# EAGLE schematic 4-Channel Lora Relay-10A v1.1 (EAGLE 6.1)
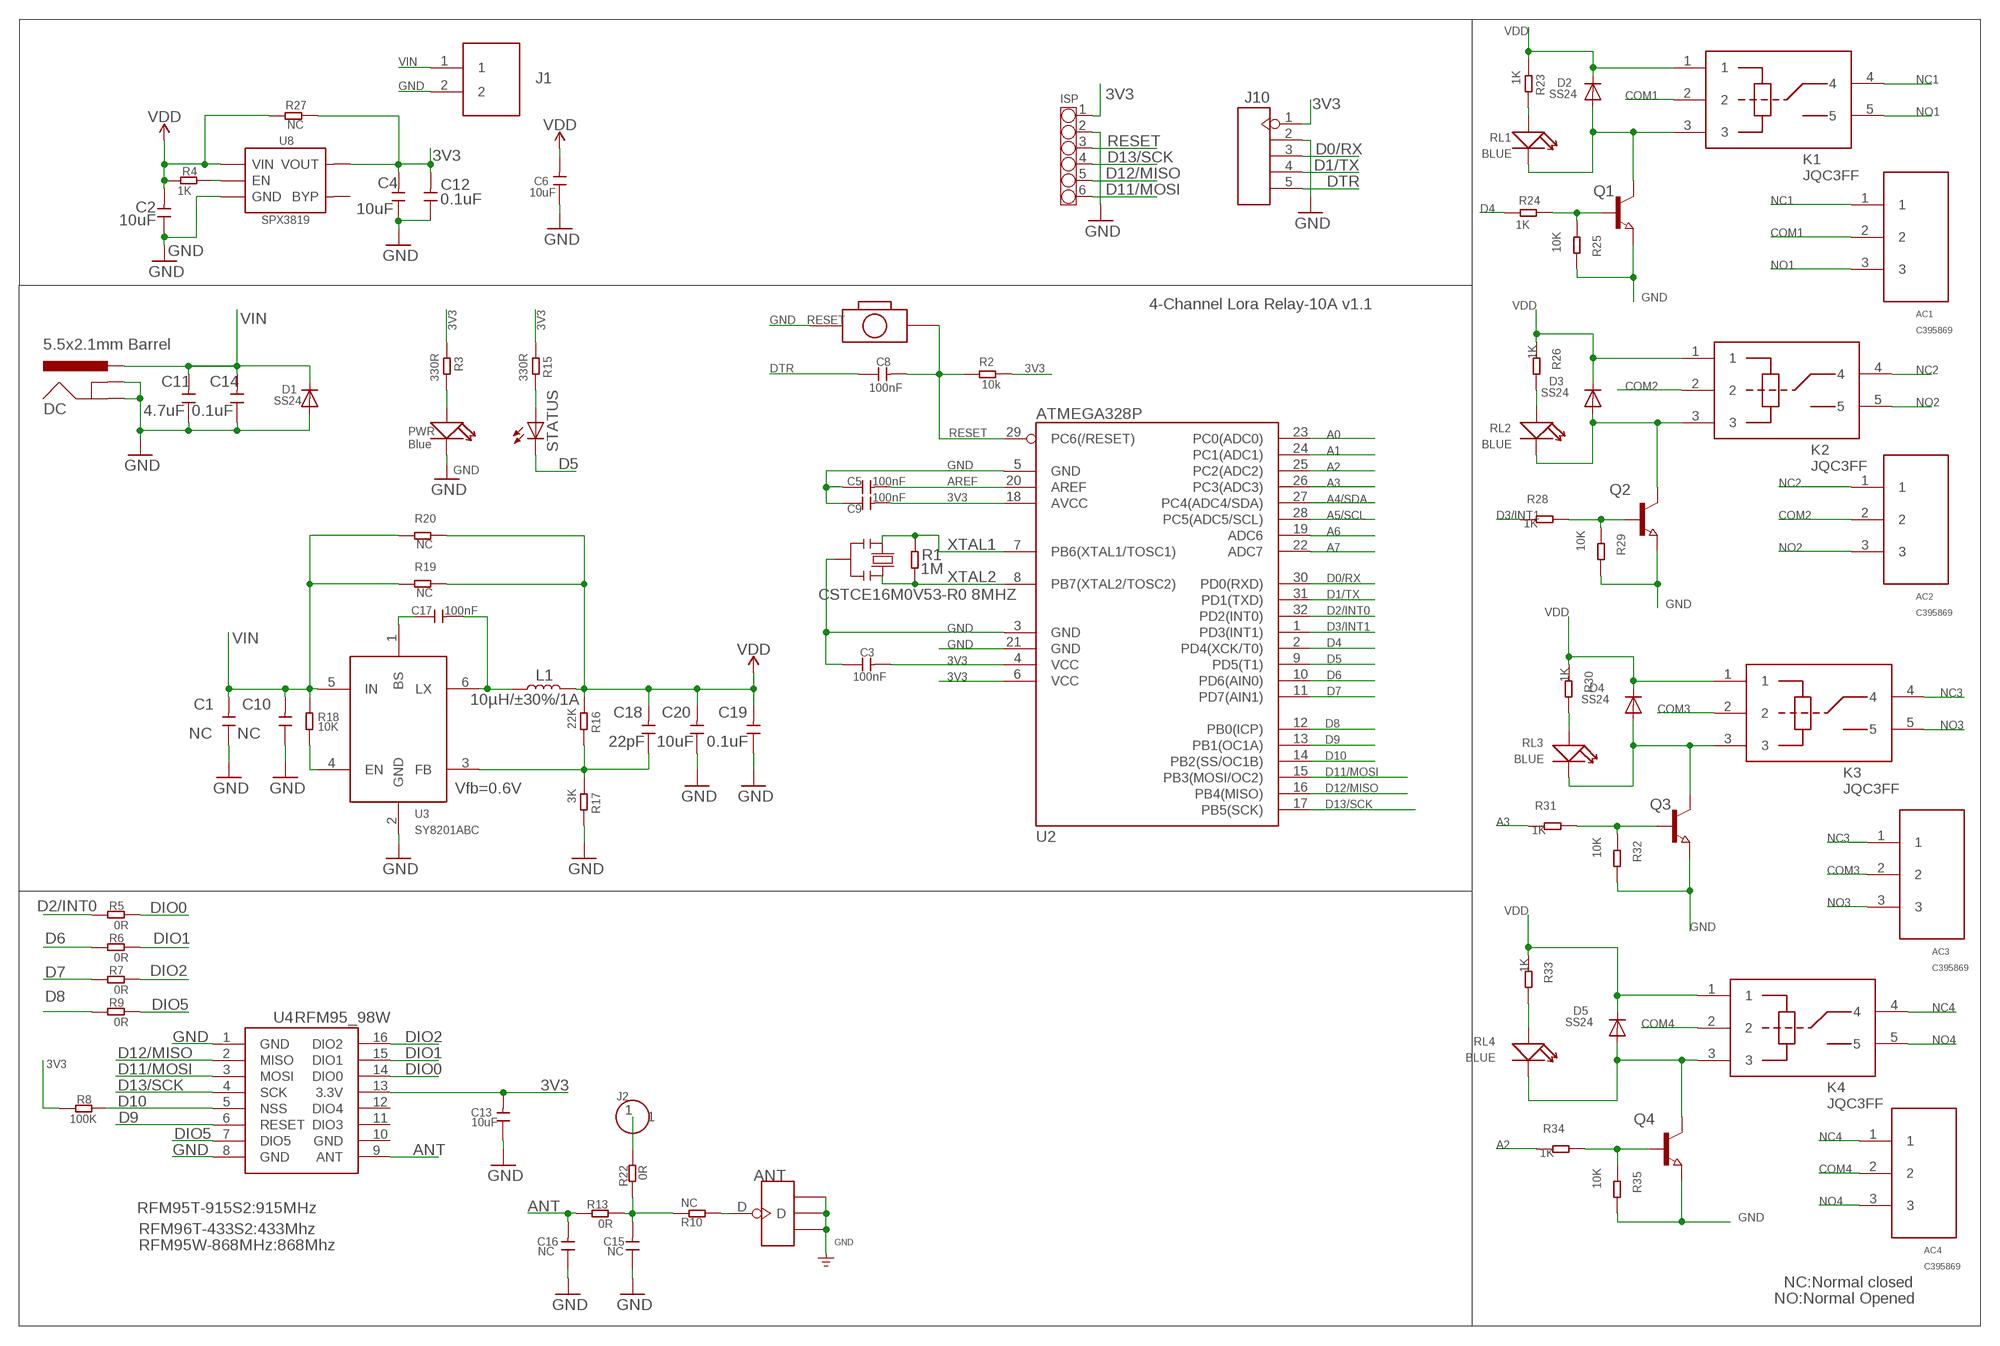
[diagram p0: schematic, sheet 1]

## Parts
AC1  C395869  [PIN_3P]
AC2  C395869  [PIN_3P]
AC3  C395869  [PIN_3P]
AC4  C395869  [PIN_3P]
ANT  ANTENNA-U-FL  [4P-U-FL]
C1  NC  C-0603  [0603]
C2  10uF  C-0603  [0603]
C3  100nF  C-0603  [0603]
C4  10uF  C-0603  [0603]
C5  100nF  C-0603  [0603]
C6  10uF  C-0603  [0603]
C8  100nF  C-0603  [0603]
C9  100nF  C-0603  [0603]
C10  NC  C-0603  [0603]
C11  4.7uF  C-0603  [0603]
C12  0.1uF  C-0603  [0603]
C13  10uF  C-0603  [0603]
C14  0.1uF  C-0603  [0603]
C15  NC  C-0603  [0603]
C16  NC  C-0603  [0603]
C17  100nF  C-0603  [0603]
C18  22pF  C-0603  [0603]
C19  0.1uF  C-0603  [0603]
C20  10uF  C-0603  [0603]
D1  SS24  DIODESMA  [SMADIODE]
D2  SS24  DIODESMA  [SMADIODE]
D3  SS24  DIODESMA  [SMADIODE]
D4  SS24  DIODESMA  [SMADIODE]
D5  SS24  DIODESMA  [SMADIODE]
DC  5.5x2.1mm Barrel  POWER_JACKSMD  [POWER_JACK_SMD]
ISP  CONNECTOR-HEADER-6P-3460270P1  [1X6P-2.54-8.5-BLACK-FEMALE]
J1  PH2.0-2P-90-DIP  [PH2.0-2P-90-DIP]
J2  HEADER-1P-50  [1P-100/50MIL]
J10  HEADER-5P-2.54  [5P-2.54]
K1  JQC3FF  [DIP5_JQC3FF]
K2  JQC3FF  [DIP5_JQC3FF]
K3  JQC3FF  [DIP5_JQC3FF]
K4  JQC3FF  [DIP5_JQC3FF]
L1  10µH/±30%/1A  INDUCTOR-CR54-47UH  [CR54]
PWR  Blue  LED'0603'  [LED-0603]
Q1  NPN-TRANSISTOR_SOT23  [SOT23]
Q2  NPN-TRANSISTOR_SOT23  [SOT23]
Q3  NPN-TRANSISTOR_SOT23  [SOT23]
Q4  NPN-TRANSISTOR_SOT23  [SOT23]
R1  1M  R-0603  [R0603]
R2  10k  R-0603  [R0603]
R3  330R  R-0603  [R0603]
R4  1K  R-0603  [R0603]
R5  0R  R-0603  [R0603]
R6  0R  R-0603  [R0603]
R7  0R  R-0603  [R0603]
R8  100K  R-0603  [R0603]
R9  0R  R-0603  [R0603]
R10  NC  R-0603  [R0603]
R13  0R  R-0603  [R0603]
R15  330R  R-0603  [R0603]
R16  22K  R-0603  [R0603]
R17  3K  R-0603  [R0603]
R18  10K  R-0603  [R0603]
R19  NC  R-0603  [R0603]
R20  NC  R-0603  [R0603]
R22  0R  R-0603  [R0603]
R23  1K  R-0603  [R0603]
R24  1K  R-0603  [R0603]
R25  10K  R-0603  [R0603]
R26  1K  R-0603  [R0603]
R27  NC  R-0603  [R0603]
R28  1K  R-0603  [R0603]
R29  10K  R-0603  [R0603]
R30  1K  R-0603  [R0603]
R31  1K  R-0603  [R0603]
R32  10K  R-0603  [R0603]
R33  1K  R-0603  [R0603]
R34  1K  R-0603  [R0603]
R35  10K  R-0603  [R0603]
RESET  BOTTON-2P-90D  [2P-7.62X3.56-90D]
RL1  BLUE  LED'0603'  [LED-0603]
RL2  BLUE  LED'0603'  [LED-0603]
RL3  BLUE  LED'0603'  [LED-0603]
RL4  BLUE  LED'0603'  [LED-0603]
STATUS  LED5MM  [LED5MM]
U2  ATMEGA328P  ATMEGA8/168/328  [TQFP32]
U3  SY8201ABC  [SOT-23-6]
U4  RFM95_98W  RFM92_93W  [RFM92_93W]
U8  SPX3819  [SOT23-5]
Y1  CSTCE16M0V53-R0 8MHZ  RESONATORMU  [RESONATOR]

## Nets
3V3: C3.2 C4.2 C9.2 C12.2 C13.2 ISP.1 J10.1 R2.1 R3.1 R8.2 R15.1 R27.2 U2.4(VCC) U2.6(VCC) U2.18(AVCC) U4.13(3.3V) U8.5(VOUT)
A0: U2.23(PC0(ADC0))
A1: U2.24(PC1(ADC1))
A2: R34.1 U2.25(PC2(ADC2))
A3: R31.1 U2.26(PC3(ADC3))
A4/SDA: U2.27(PC4(ADC4/SDA))
A5/SCL: U2.28(PC5(ADC5/SCL))
A6: U2.19(ADC6)
A7: U2.22(ADC7)
ANT: C16.2 R13.2 U4.9(ANT)
AREF: C5.2 U2.20(AREF)
COM1: AC1.2 K1.2
COM2: AC2.2 K2.2
COM3: AC3.2 K3.2
COM4: AC4.2 K4.2
D0/RX: J10.3 U2.30(PD0(RXD))
D1/TX: J10.4 U2.31(PD1(TXD))
D2/INT0: R5.1 U2.32(PD2(INT0))
D3/INT1: R28.1 U2.1(PD3(INT1))
D4: R24.1 U2.2(PD4(XCK/T0))
D5: STATUS.K(C) U2.9(PD5(T1))
D6: R6.1 U2.10(PD6(AIN0))
D7: R7.1 U2.11(PD7(AIN1))
D8: R9.1 U2.12(PB0(ICP))
D9: U2.13(PB1(OC1A)) U4.6(RESET)
D10: R8.1 U2.14(PB2(SS/OC1B)) U4.5(NSS)
D11/MOSI: ISP.6 U2.15(PB3(MOSI/OC2)) U4.3(MOSI)
D12/MISO: ISP.5 U2.16(PB4(MISO)) U4.2(MISO)
D13/SCK: ISP.4 U2.17(PB5(SCK)) U4.4(SCK)
DIO0: R5.2 U4.14(DIO0)
DIO1: R6.2 U4.15(DIO1)
DIO2: R7.2 U4.16(DIO2)
DIO5: R9.2 U4.7(DIO5)
DTR: C8.1 J10.5
GND: ANT.GND1 ANT.GND2 ANT.GND3 C1.1 C2.1 C3.1 C4.1 C5.1 C6.1 C9.1 C10.1 C11.1 C12.1 C13.1 C14.1 C15.1 C16.1 C19.1 C20.1 D1.A DC.GND(GNDBREAK) DC.P$4(GND) ISP.2 J1.2 J10.2 PWR.- Q1.2(E) Q2.2(E) Q3.2(E) Q4.2(E) R17.2 R25.2 R29.2 R32.2 R35.2 RESET.P$1 U2.3(GND) U2.5(GND) U2.21(GND) U3.2(GND) U4.1(GND) U4.8(GND) U8.2(GND) Y1.2
N$1: ANT.D R10.2
N$3: R23.2 RL1.+
N$4: C15.2 R10.1 R13.1 R22.2
N$5: R15.2 STATUS.A
N$6: C17.2 L1.P$1 U3.6(LX)
N$7: PWR.+ R3.2
N$8: C17.1 U3.1(BS)
N$9: D2.A K1.3 Q1.3(C) RL1.-
N$10: C18.1 R16.2 R17.1 U3.3(FB)
N$11: R18.2 U3.4(EN)
N$12: J2.1 R22.1
N$14: Q1.1(B) R24.2 R25.1
N$20: R26.2 RL2.+
N$21: D3.A K2.3 Q2.3(C) RL2.-
N$23: Q2.1(B) R28.2 R29.1
N$24: R4.2 U8.3(EN)
N$35: R30.2 RL3.+
N$36: D4.A K3.3 Q3.3(C) RL3.-
N$38: Q3.1(B) R31.2 R32.1
N$47: R33.2 RL4.+
N$48: D5.A K4.3 Q4.3(C) RL4.-
N$53: Q4.1(B) R34.2 R35.1
NC1: AC1.1 K1.4
NC2: AC2.1 K2.4
NC3: AC3.1 K3.4
NC4: AC4.1 K4.4
NO1: AC1.3 K1.5
NO2: AC2.3 K2.5
NO3: AC3.3 K3.5
NO4: AC4.3 K4.5
RESET: C8.2 ISP.3 R2.2 RESET.P$2 U2.29(PC6(/RESET))
VDD: C2.2 C6.2 C18.2 C19.2 C20.2 D2.C D3.C D4.C D5.C K1.1 K2.1 K3.1 K4.1 L1.P$2 R4.1 R16.1 R19.2 R20.2 R23.1 R26.1 R27.1 R30.1 R33.1 U8.1(VIN)
VIN: C1.2 C10.2 C11.2 C14.2 D1.C DC.VIN0(PWR) J1.1 R18.1 R19.1 R20.1 U3.5(IN)
XTAL1: R1.2 U2.7(PB6(XTAL1/TOSC1)) Y1.1
XTAL2: R1.1 U2.8(PB7(XTAL2/TOSC2)) Y1.3
Unconnected: U4.11(DIO3) U4.12(DIO4) U8.4(BYP)

## Notes on the sheet
- J1
- 4-Channel Lora Relay-10A v1.1
- Vfb=0.6V
- RFM95T-915S2:915MHz
- RFM96T-433S2:433Mhz
- RFM95W-868MHz:868Mhz
- NC:Normal closed
- NO:Normal Opened

## Power pins joined to a net without a drawn wire
GND: U4.10(GND)

## Library data of the parts
AC1-AC4 = 1mytest:C395869
ANT = Connector:ANTENNA-U-FL
C1-C6 C8-C20 = Discrete:C*: Ceramic Capacitors
D1-D5 = adafruit:DIODE: Diode SMADIODE - SMA Surface Mount Package 20V 1A Schottky Diode Digikey: 641-1014-6-ND DO-1N4148 - Through Hole Small Current Diode SOD-123 20V 1 A (.5mV Vf) Schottky Diode - Digikey: MBRX120TPMSCT-ND SOD-323 10V 570mA (.38mV Vf, 3ns) Schottky Diode - Digikey: ZLLS410CT-ND SOD-523 30V 30mA Schottky Diode (RB751S-40TE61) - Digikey: RB751S-40TE61CT-ND SOT23-R/W - SOT23 Package (R = Solder Paste/Reflow Ovens, W = Hand-Soldering) BAT54Film 40V 300mA - Digikey: 497-7162-1-ND
DC = SparkFun-Connectors:POWER_JACK: Power Jack Connector This is the standard 5.5mm barrel jack for power. The PTH is the most common, proven, reliable, footprint. The Slot footprint only works if the mill layer is transmitted to the PCB fab house so be warned. Here are the connectors we sell at SparkFun: DC Barrel Power Jack/Connector <https://www.sparkfun.com/products/119> (PRT-00119) DC Barrel Power Jack/Connector (SMD) <https://www.sparkfun.com/products/12748> (PRT-12748) DC Barrel Jack Adapter - Breadboard Compatible <https://www.sparkfun.com/products/10811> (PRT-10811) It is used on this SparkFun product (and many, many others): SparkFun RedBoard - Programmed with Arduino <https://www.sparkfun.com/products/12757> (DEV-12757) Also, if you need a mating power supply or connector, please check these out: Wall Adapter Power Supply - 9VDC 650mA <https://www.sparkfun.com/products/298> (TOL-00298) DC Barrel Jack Adapter - Male <https://www.sparkfun.com/products/10287> (PRT-10287); PROD_ID: CONN-08106; SF_ID: PRT-12748
ISP = OPL Eagle Library:CONNECTOR-HEADER-6P
J1 = Connector:PH2.0-2P-90-DIP
J2 = Connector:HEADER-1P
J10 = Connector:HEADER-5P
K1-K4 = 1mytest:JQC3FF
L1 = SparkFun-Coils:INDUCTOR: Inductors Resist changes in electrical current. Basically a coil of wire. SparkFun Products: SparkFun Load Cell Amplifier - HX711 <https://www.sparkfun.com/products/13879> IOIO-OTG - V2.2 <https://www.sparkfun.com/products/13613>; PROD_ID: NDUC-10789; VALUE: 47µH/±30%/750mA
PWR RL1-RL4 = Discrete:LED*
Q1-Q4 = semicon-smd-ipc:NPN-TRANSISTOR_: NPN TRANSISTOR
R1-R10 R13 R15-R20 R22-R35 = Discrete:R*
RESET = Discrete:BOTTON-2P
STATUS = led:LED: LED OSRAM: - CHIPLED LG R971, LG N971, LY N971, LG Q971, LY Q971, LO R971, LY R971 LH N974, LH R974 LS Q976, LO Q976, LY Q976 LO Q996 - Hyper CHIPLED LW Q18S LB Q993, LB Q99A, LB R99A - SideLED LS A670, LO A670, LY A670, LG A670, LP A670 LB A673, LV A673, LT A673, LW A673 LH A674 LY A675 LS A676, LA A676, LO A676, LY A676, LW A676 LS A679, LY A679, LG A679 - Hyper Micro SIDELED® LS Y876, LA Y876, LO Y876, LY Y876 LT Y87S - SmartLED LW L88C, LW L88S LB L89C, LB L89S, LG L890 LS L89K, LO L89K, LY L89K LS L896, LA L896, LO L896, LY L896 - TOPLED LS T670, LO T670, LY T670, LG T670, LP T670 LSG T670, LSP T670, LSY T670, LOP T670, LYG T670 LG T671, LOG T671, LSG T671 LB T673, LV T673, LT T673, LW T673 LH T674 LS T676, LA T676, LO T676, LY T676, LB T676, LH T676, LSB T676, LW T676 LB T67C, LV T67C, LT T67C, LS T67K, LO T67K, LY T67K, LW E67C LS E67B, LA E67B, LO E67B, LY E67B, LB E67C, LV E67C, LT E67C LW T67C LS T679, LY T679, LG T679 LS T770, LO T770, LY T770, LG T770, LP T770 LB T773, LV T773, LT T773, LW T773 LH T774 LS E675, LA E675, LY E675, LS T675 LS T776, LA T776, LO T776, LY T776, LB T776 LHGB T686 LT T68C, LB T68C - Hyper Mini TOPLED® LB M676 - Mini TOPLED Santana® LG M470 LS M47K, LO M47K, LY M47K Source: http://www.osram.convergy.de LUXEON: - LUMILED® LXK2-PW12-R00, LXK2-PW12-S00, LXK2-PW14-U00, LXK2-PW14-V00 LXK2-PM12-R00, LXK2-PM12-S00, LXK2-PM14-U00 LXK2-PE12-Q00, LXK2-PE12-R00, LXK2-PE12-S00, LXK2-PE14-T00, LXK2-PE14-U00 LXK2-PB12-K00, LXK2-PB12-L00, LXK2-PB12-M00, LXK2-PB14-N00, LXK2-PB14-P00, LXK2-PB14-Q00 LXK2-PR12-L00, LXK2-PR12-M00, LXK2-PR14-Q00, LXK2-PR14-R00 LXK2-PD12-Q00, LXK2-PD12-R00, LXK2-PD12-S00 LXK2-PH12-R00, LXK2-PH12-S00 LXK2-PL12-P00, LXK2-PL12-Q00, LXK2-PL12-R00 Source: www.luxeon.com KINGBRIGHT: KA-3528ASYC Source: www.kingbright.com
U2 = IC:ATMEGA8/168/328: MICROCONTROLLER
U3 = self:SY8201ABC
U4 = dragino:RFM92_93W
U8 = IC:SPX3819
Y1 = SmartPrj:RESONATOR

## Net classes
0 default: width 0.152 mm, drill 0.305 mm, clearance 0.152 mm
2 gnd: width 0.305 mm, drill 0.559 mm, clearance 0.254 mm
3 usbvcc: width 0.508 mm, drill 0.61 mm, clearance 0.254 mm